# EAGLE board Main_Board (EAGLE 9.2.0), part 1 of 2
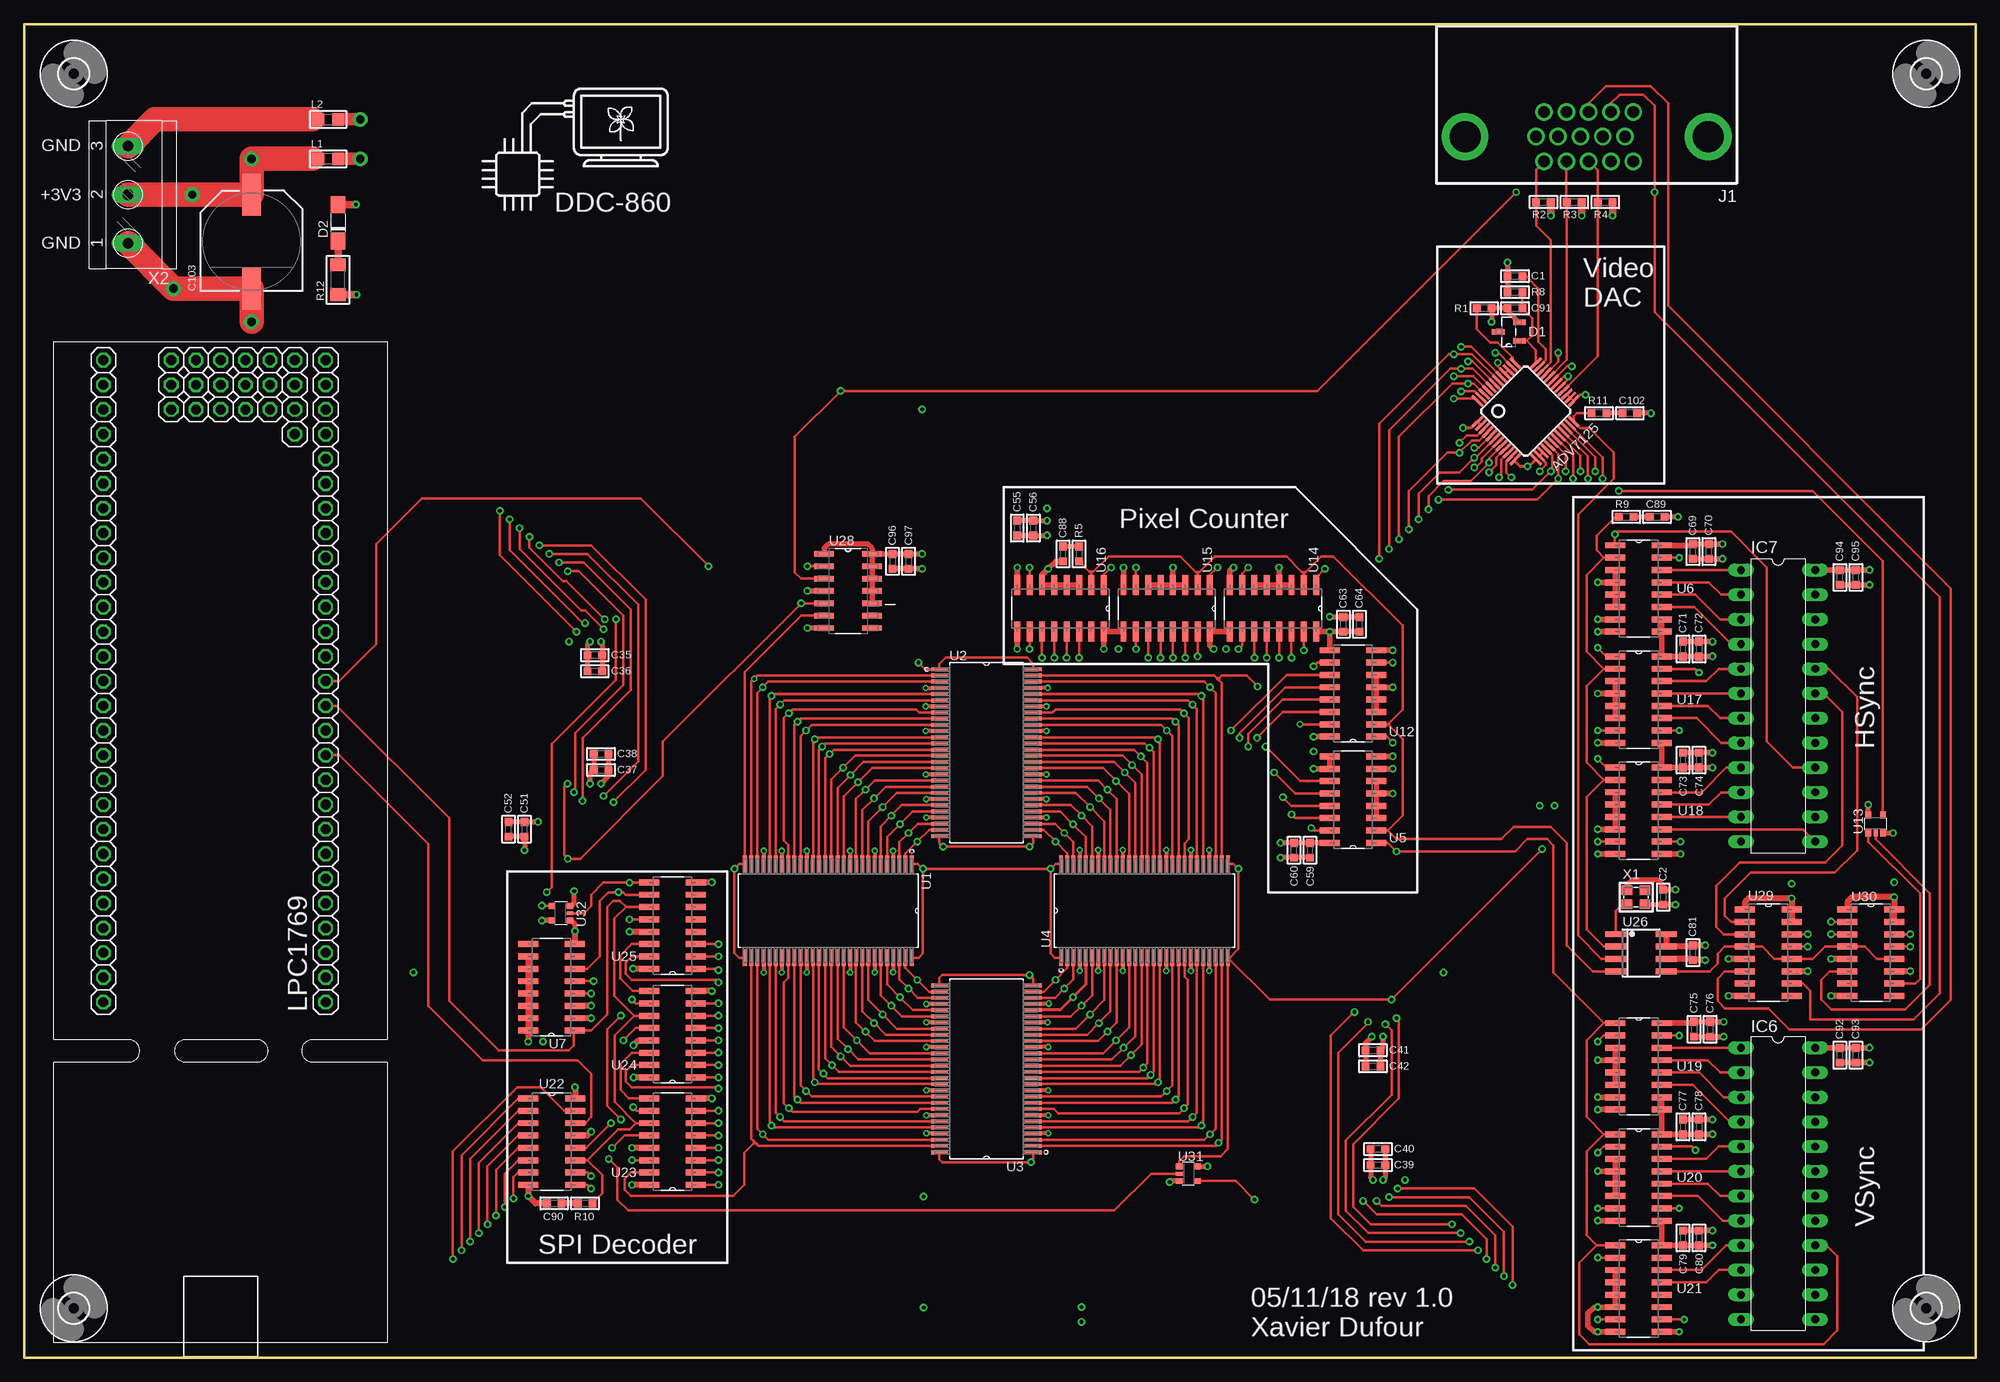
[diagram p4: board, top side]
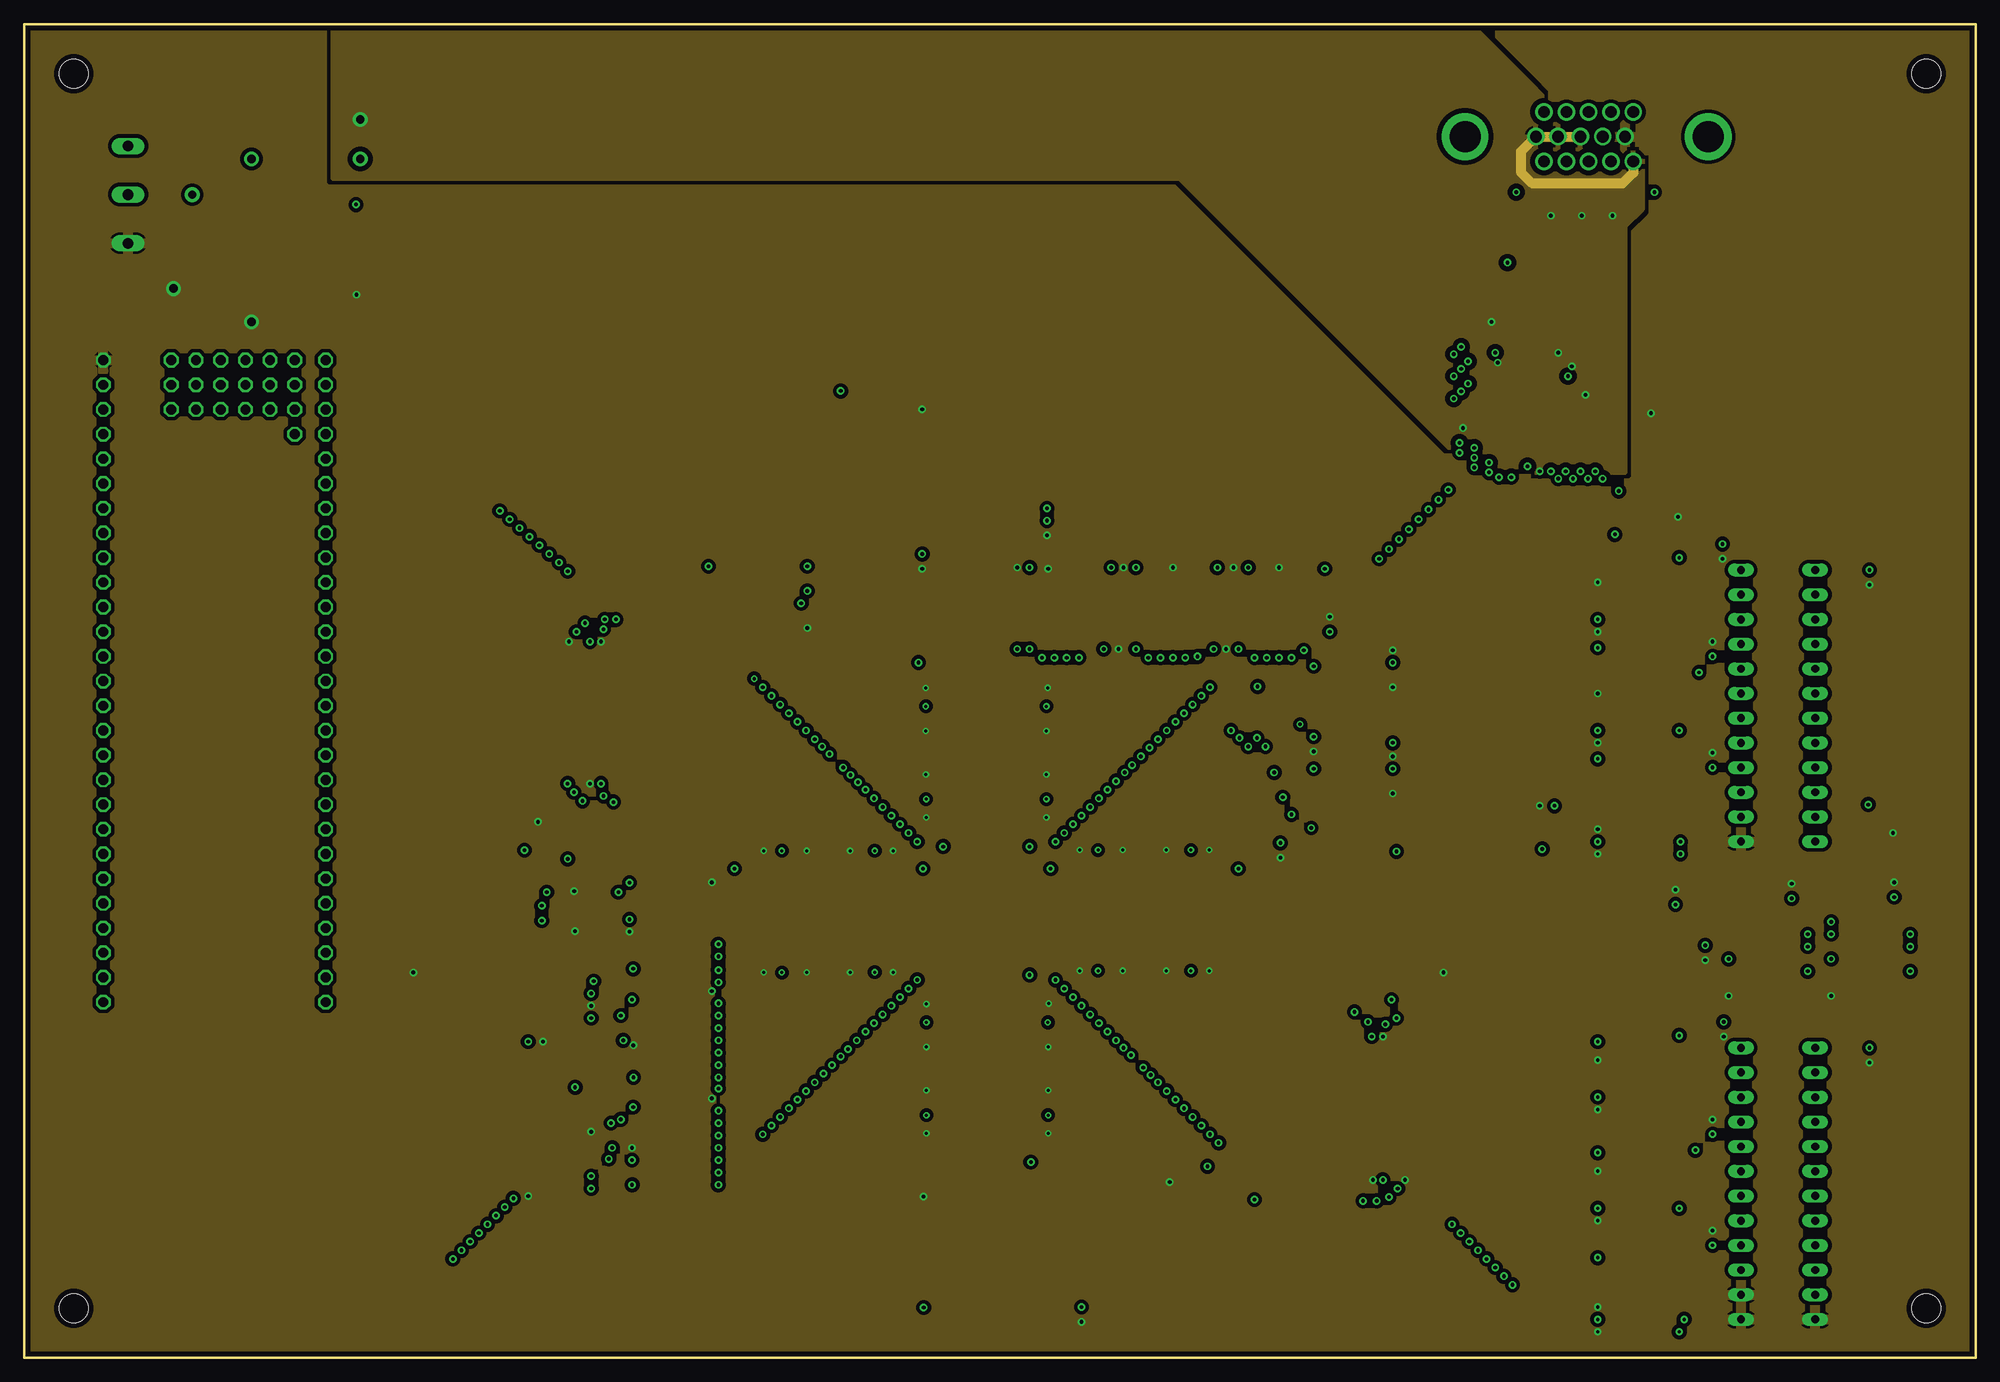
[diagram p5: board, inner layer GND]
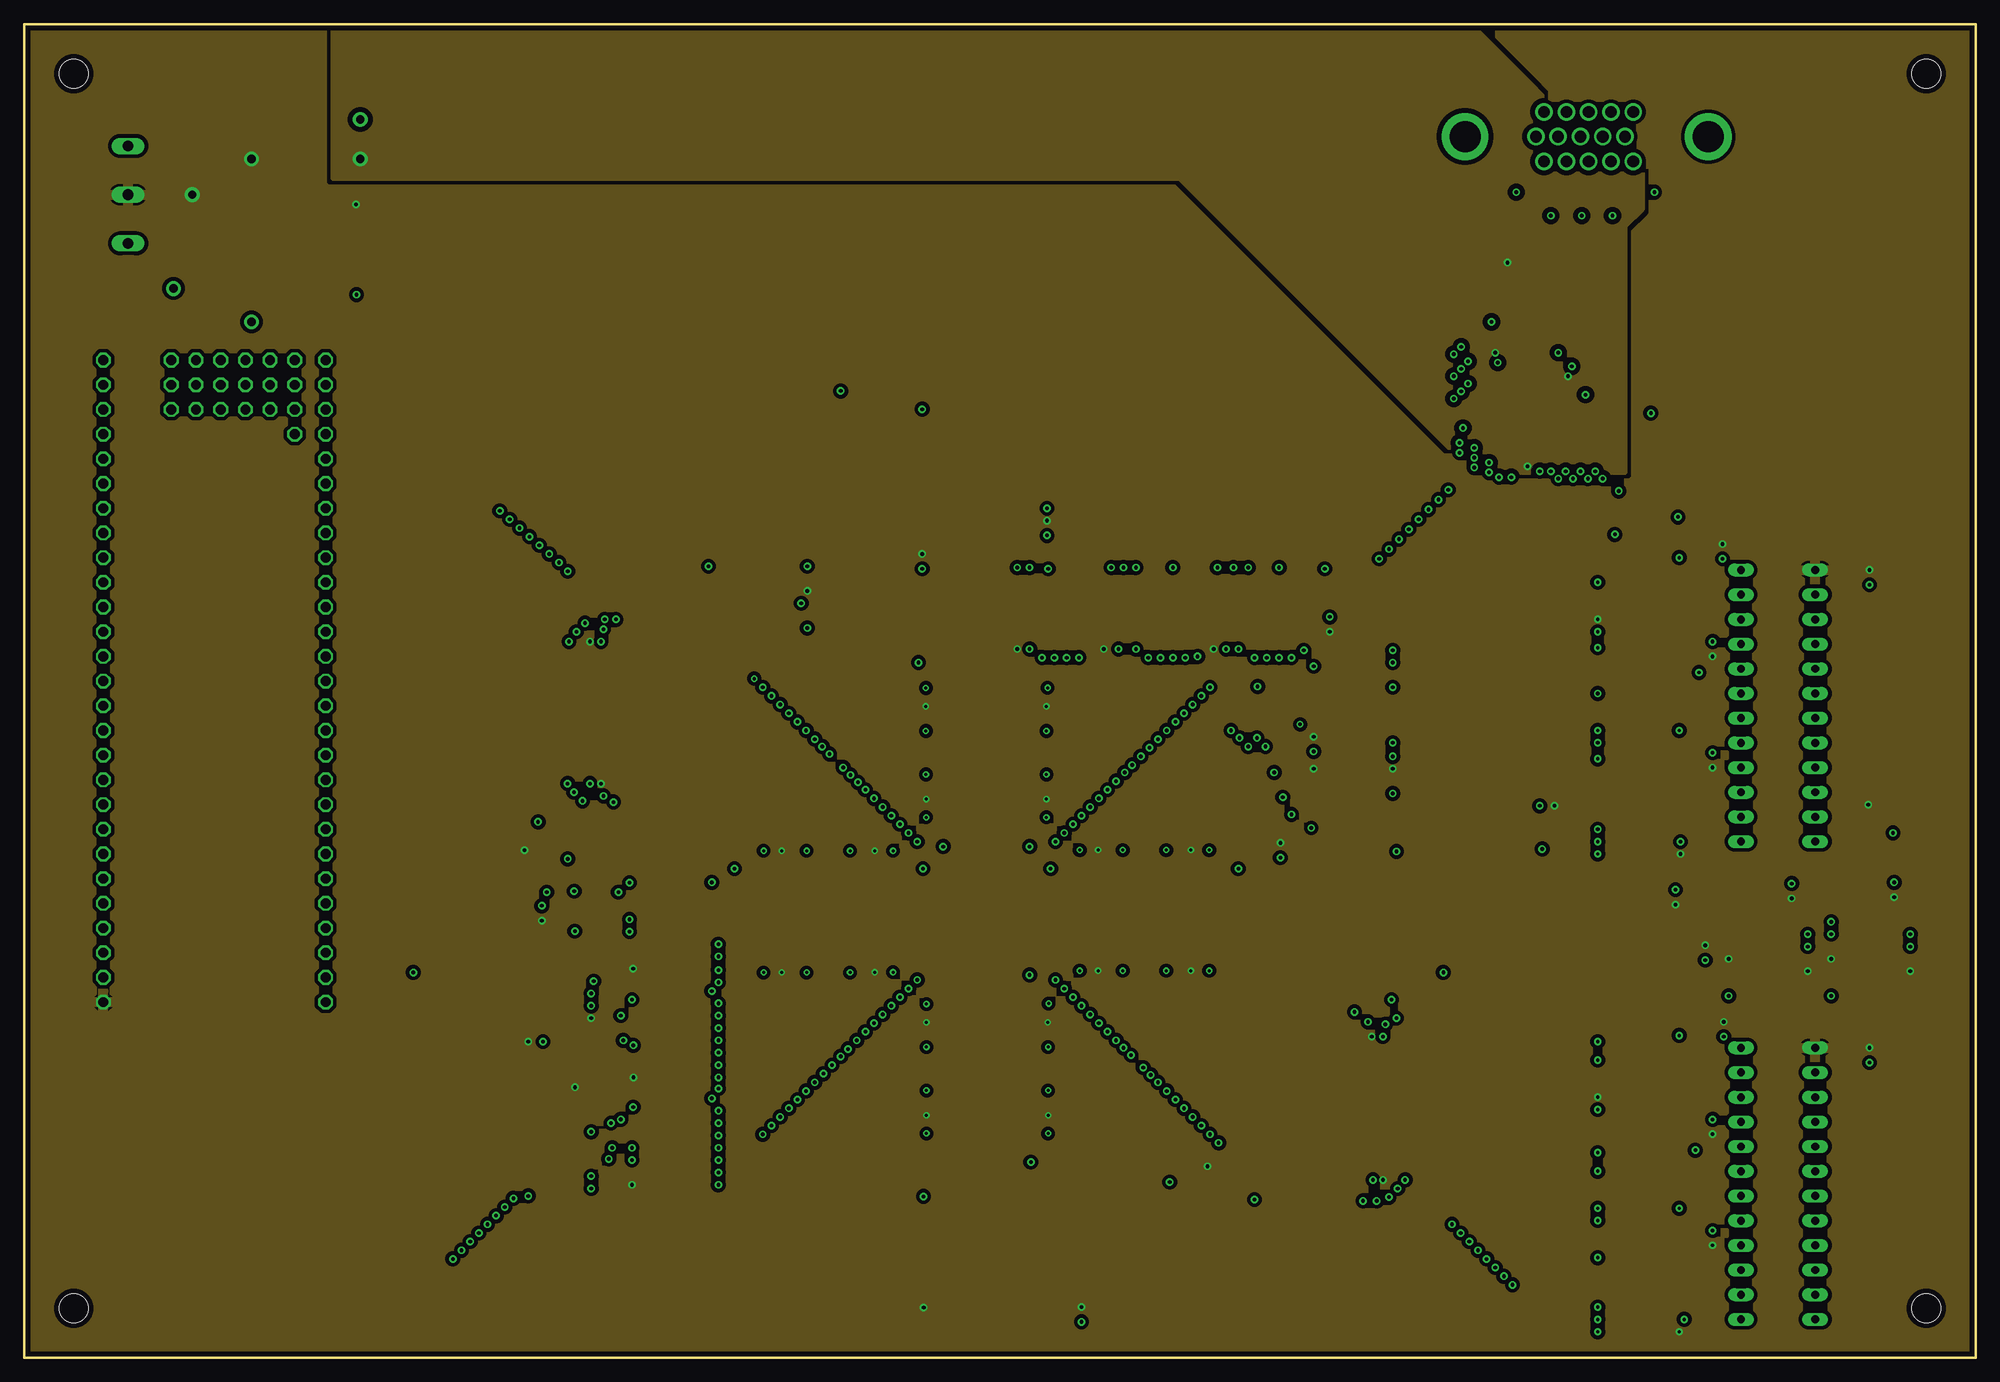
[diagram p6: board, inner layer PWR]
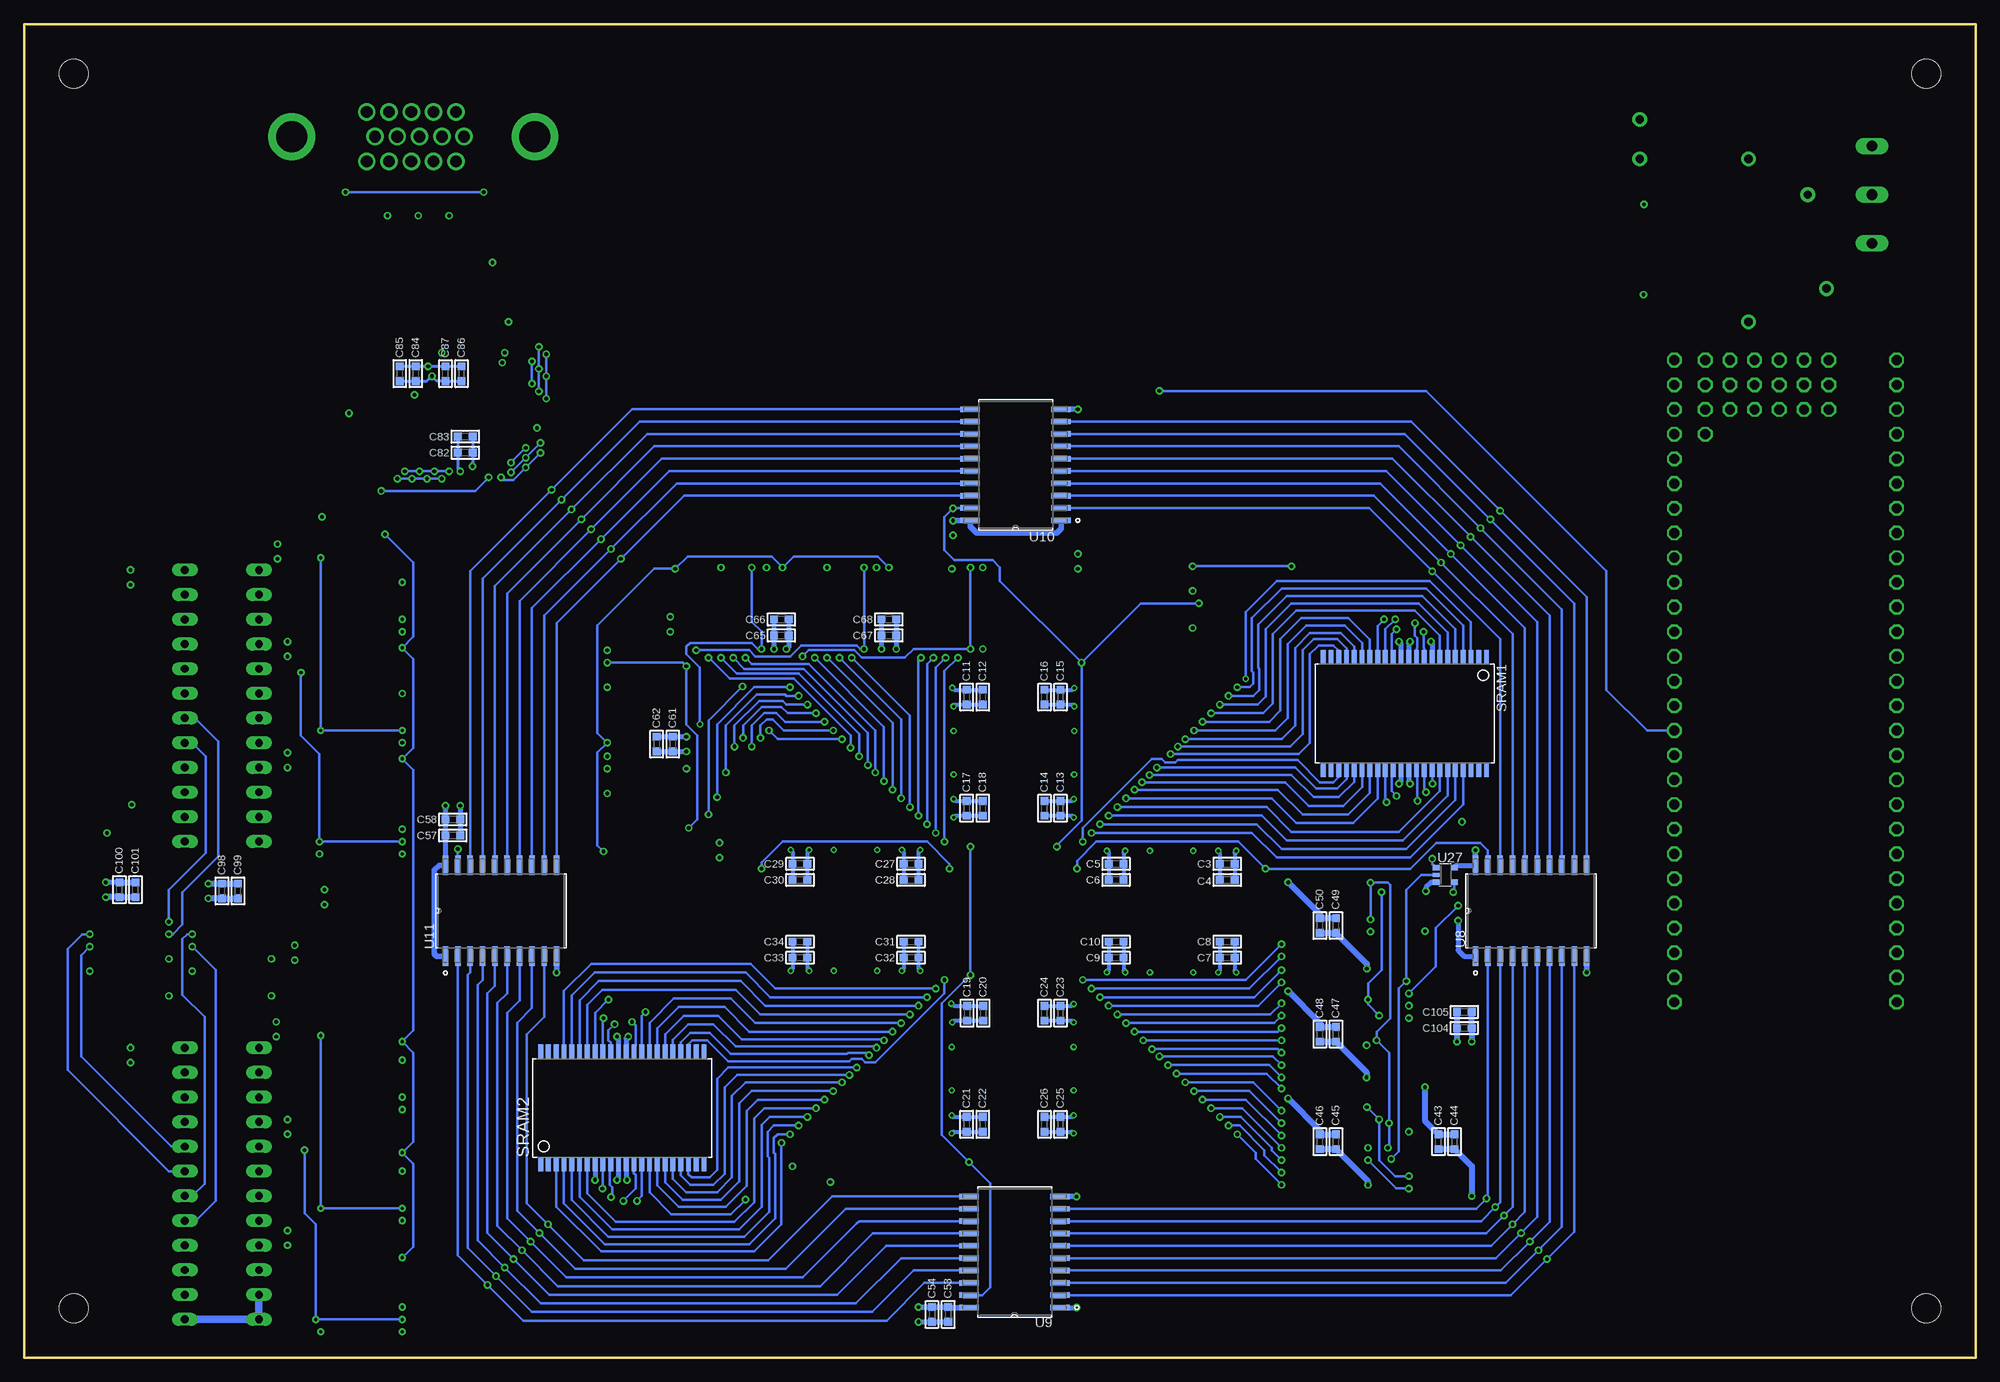
[diagram p7: board, bottom side, seen from below]

Size 200.66 x 137.16 mm. Coordinates in mm from the lower left corner, seen from the top.
Outline: 0,0 200.66,0 200.66,137.16 0,137.16 0,0
Copper layers (1+(2*15)+16): Top 0.035mm / dielectric 0.11mm / GND 0.035mm / dielectric 1.13mm / PWR 0.035mm / dielectric 0.11mm / Bottom 0.035mm
Design rules "DRCxav *": minimum track width 7mil, minimum drill 10mil, track to track 6mil, track to pad 6mil, pad to pad 6mil, via to via 6mil, smd to smd 6mil, copper to edge 20mil, drill to drill 10mil, minimum pad ring 10mil, minimum via ring 6mil, stop-mask expansion 0mil, vias tented up to drill 0mil, thermal gap 10mil

## Footprints (pad centres in the part's own frame; a part is rotated, then mirrored left to right if it is on the bottom)
LQFP48(SOT313) = smd 0.28 x 1.5: 1 -2.75,-4.25; 2 -2.25,-4.25; 3 -1.75,-4.25; 4 -1.25,-4.25; 5 -0.75,-4.25; 6 -0.25,-4.25; 7 0.25,-4.25; 8 0.75,-4.25; 9 1.25,-4.25; 10 1.75,-4.25; 11 2.25,-4.25; 12 2.75,-4.25; 25 2.75,4.25; 26 2.25,4.25; 27 1.75,4.25; 28 1.25,4.25; 29 0.75,4.25; 30 0.25,4.25; 31 -0.25,4.25; 32 -0.75,4.25; 33 -1.25,4.25; 34 -1.75,4.25; 35 -2.25,4.25; 36 -2.75,4.25 | smd 1.5 x 0.28: 13 4.25,-2.75; 14 4.25,-2.25; 15 4.25,-1.75; 16 4.25,-1.25; 17 4.25,-0.75; 18 4.25,-0.25; 19 4.25,0.25; 20 4.25,0.75; 21 4.25,1.25; 22 4.25,1.75; 23 4.25,2.25; 24 4.25,2.75; 37 -4.25,2.75; 38 -4.25,2.25; 39 -4.25,1.75; 40 -4.25,1.25; 41 -4.25,0.75; 42 -4.25,0.25; 43 -4.25,-0.25; 44 -4.25,-0.75; 45 -4.25,-1.25; 46 -4.25,-1.75; 47 -4.25,-2.25; 48 -4.25,-2.75
C0603 = smd 0.8 x 0.8: 1 -0.762,0; 2 0.762,0
CSV-G = smd 4.318 x 1.93: + -4.826,0; - 4.826,0
TO236-3(SOT23) = smd 1.321 x 0.559: 1 -1.092,0.94; 2 -1.092,-0.94; 3 1.092,0
DEL1206 = smd 1.75 x 1.5: A -1.875,0; C 1.875,0
3MM_HOLE = hole 3: 0,0
DIP24 = drill 0.813 long: 1 -13.97,-3.81; 2 -11.43,-3.81; 3 -8.89,-3.81; 4 -6.35,-3.81; 5 -3.81,-3.81; 6 -1.27,-3.81; 7 1.27,-3.81; 8 3.81,-3.81; 9 6.35,-3.81; 10 8.89,-3.81; 11 11.43,-3.81; 12 13.97,-3.81; 13 13.97,3.81; 14 11.43,3.81; 15 8.89,3.81; 16 6.35,3.81; 17 3.81,3.81; 18 1.27,3.81; 19 -1.27,3.81; 20 -3.81,3.81; 21 -6.35,3.81; 22 -8.89,3.81; 23 -11.43,3.81; 24 -13.97,3.81
DB15-VGA-90DEG = drill 1.194: 1 4.371,2.541; 2 2.08,2.541; 3 -0.211,2.541; 4 -2.502,2.541; 5 -4.793,2.541; 6 5.217,0; 7 2.926,0; 8 0.635,0; 9 -1.656,0; 10 -3.947,0; 11 4.371,-2.541; 12 2.08,-2.541; 13 -0.211,-2.541; 14 -2.502,-2.541; 15 -4.793,-2.541 | drill 3.2: P$1 -12.502,0; P$2 12.502,0
L0805 = smd 1.2 x 1.3: 1 -1.016,0; 2 1.016,0
LPCXPRESSO_LPC1769 = drill 1 octagon: 1 -18.161,-11.049; 2 -15.621,-11.049; 3 -13.081,-11.049; 4 -10.541,-11.049; 5 -8.001,-11.049; 6 -5.461,-11.049; 7 -2.921,-11.049; 8 -0.381,-11.049; 9 2.159,-11.049; 10 4.699,-11.049; 11 7.239,-11.049; 12 9.779,-11.049; 13 12.319,-11.049; 14 14.859,-11.049; 15 17.399,-11.049; 16 19.939,-11.049; 17 22.479,-11.049; 18 25.019,-11.049; 19 27.559,-11.049; 20 30.099,-11.049; 21 32.639,-11.049; 22 35.179,-11.049; 23 37.719,-11.049; 24 40.259,-11.049; 25 42.799,-11.049; 26 45.339,-11.049; 27 47.879,-11.049; 28 -18.161,11.811; 29 -15.621,11.811; 30 -13.081,11.811; 31 -10.541,11.811; 32 -8.001,11.811; 33 -5.461,11.811; 34 -2.921,11.811; 35 -0.381,11.811; 36 2.159,11.811; 37 4.699,11.811; 38 7.239,11.811; 39 9.779,11.811; 40 12.319,11.811; 41 14.859,11.811; 42 17.399,11.811; 43 19.939,11.811; 44 22.479,11.811; 45 25.019,11.811; 46 27.559,11.811; 47 30.099,11.811; 48 32.639,11.811; 49 35.179,11.811; 50 37.719,11.811; 51 40.259,11.811; 52 42.799,11.811; 53 45.339,11.811; 54 47.879,11.811; 55 40.259,-7.874; 56 42.799,-7.874; 57 45.339,-7.874; 58 47.879,-7.874; 59 42.799,-5.334; 60 45.339,-5.334; 61 47.879,-5.334; 62 42.799,-2.794; 63 45.339,-2.794; 64 47.879,-2.794; 65 42.799,-0.254; 66 45.339,-0.254; 67 47.879,-0.254; 68 42.799,2.286; 69 45.339,2.286; 70 47.879,2.286; 71 42.799,4.826; 72 45.339,4.826; 73 47.879,4.826
R0603 = smd 0.8 x 0.8: 1 -0.762,0; 2 0.762,0
R1206 = smd 1.3 x 1.6: 1 -1.524,0; 2 1.524,0
TSOPII-44 = smd 0.5 x 1.5: 1 -8.4,-5.777; 2 -7.6,-5.777; 3 -6.8,-5.777; 4 -6,-5.777; 5 -5.2,-5.777; 6 -4.4,-5.777; 7 -3.6,-5.777; 8 -2.8,-5.777; 9 -2,-5.777; 10 -1.2,-5.777; 11 -0.4,-5.777; 12 0.4,-5.777; 13 1.2,-5.777; 14 2,-5.777; 15 2.8,-5.777; 16 3.6,-5.777; 17 4.4,-5.777; 18 5.2,-5.777; 19 6,-5.777; 20 6.8,-5.777; 21 7.6,-5.777; 22 8.4,-5.777; 23 8.4,5.777; 24 7.6,5.777; 25 6.8,5.777; 26 6,5.777; 27 5.2,5.777; 28 4.4,5.777; 29 3.6,5.777; 30 2.8,5.777; 31 2,5.777; 32 1.2,5.777; 33 0.4,5.777; 34 -0.4,5.777; 35 -1.2,5.777; 36 -2,5.777; 37 -2.8,5.777; 38 -3.6,5.777; 39 -4.4,5.777; 40 -5.2,5.777; 41 -6,5.777; 42 -6.8,5.777; 43 -7.6,5.777; 44 -8.4,5.777
SSOP56(SOT371) = smd 1.727 x 0.406: 1 -4.826,8.585; 2 -4.826,7.925; 3 -4.826,7.315; 4 -4.826,6.655; 5 -4.826,6.045; 6 -4.826,5.385; 7 -4.826,4.775; 8 -4.826,4.115; 9 -4.826,3.505; 10 -4.826,2.845; 11 -4.826,2.235; 12 -4.826,1.575; 13 -4.826,0.965; 14 -4.826,0.305; 15 -4.826,-0.305; 16 -4.826,-0.965; 17 -4.826,-1.575; 18 -4.826,-2.235; 19 -4.826,-2.845; 20 -4.826,-3.505; 21 -4.826,-4.115; 22 -4.826,-4.775; 23 -4.826,-5.385; 24 -4.826,-6.045; 25 -4.826,-6.655; 26 -4.826,-7.315; 27 -4.826,-7.925; 28 -4.826,-8.585; 29 4.826,-8.585; 30 4.826,-7.925; 31 4.826,-7.315; 32 4.826,-6.655; 33 4.826,-6.045; 34 4.826,-5.385; 35 4.826,-4.775; 36 4.826,-4.115; 37 4.826,-3.505; 38 4.826,-2.845; 39 4.826,-2.235; 40 4.826,-1.575; 41 4.826,-0.965; 42 4.826,-0.305; 43 4.826,0.305; 44 4.826,0.965; 45 4.826,1.575; 46 4.826,2.235; 47 4.826,2.845; 48 4.826,3.505; 49 4.826,4.115; 50 4.826,4.775; 51 4.826,5.385; 52 4.826,6.045; 53 4.826,6.655; 54 4.826,7.315; 55 4.826,7.925; 56 4.826,8.585
SO16D(SOT109) = smd 2.057 x 0.61: 1 -2.388,4.445; 2 -2.388,3.175; 3 -2.388,1.905; 4 -2.388,0.635; 5 -2.388,-0.635; 6 -2.388,-1.905; 7 -2.388,-3.175; 8 -2.388,-4.445; 9 2.413,-4.445; 10 2.413,-3.175; 11 2.413,-1.905; 12 2.413,-0.635; 13 2.413,0.635; 14 2.413,1.905; 15 2.413,3.175; 16 2.413,4.445
SO20DW(SOT163) = smd 1.981 x 0.559: 1 -4.674,5.715; 2 -4.674,4.445; 3 -4.674,3.175; 4 -4.674,1.905; 5 -4.674,0.635; 6 -4.674,-0.635; 7 -4.674,-1.905; 8 -4.674,-3.175; 9 -4.674,-4.445; 10 -4.674,-5.715; 11 4.674,-5.715; 12 4.674,-4.445; 13 4.674,-3.175; 14 4.674,-1.905; 15 4.674,-0.635; 16 4.674,0.635; 17 4.674,1.905; 18 4.674,3.175; 19 4.674,4.445; 20 4.674,5.715
SC70-5(SOT353) = smd 0.6 x 0.7: 1 -0.75,-1; 3 0.75,-1; 4 0.75,0.85; 5 -0.75,0.85 | smd 0.4 x 0.7: 2 0,-1
SO08(SOT96) = smd 0.6 x 2.2: 1 -1.905,-2.6; 2 -0.635,-2.6; 3 0.635,-2.6; 4 1.905,-2.6; 5 1.905,2.6; 6 0.635,2.6; 7 -0.635,2.6; 8 -1.905,2.6
SO14(SOT108) = smd 1.981 x 0.559: 1 -2.464,3.81; 2 -2.464,2.54; 3 -2.464,1.27; 4 -2.464,0; 5 -2.464,-1.27; 6 -2.464,-2.54; 7 -2.464,-3.81; 8 2.464,-3.81; 9 2.464,-2.54; 10 2.464,-1.27; 11 2.464,0; 12 2.464,1.27; 13 2.464,2.54; 14 2.464,3.81
OSCXO2.5X2.0 = smd 1.05 x 0.95: 1 -0.925,-0.725; 2 0.925,-0.725; 3 0.925,0.725; 4 -0.925,0.725
TERMINAL-BLOCK-3-PIN-5MM = drill 1.1 pad 1.7 long: 1 -5,0; 2 0,0; 3 5,0

## Placement (x,y rotation side)
ADV7125  ADV7125  [LQFP48(SOT313)]  154.38,97.36 315 top
C1  0.1µF  [C0603]  153.29,111.25 180 top
C2  0.01µF  [C0603]  168.53,47.37 270 top
C3  0.01µF  [C0603]  76.96,50.8 180 bottom
C4  0.1µF  [C0603]  76.96,49.15 180 bottom
C5  0.01µF  [C0603]  88.39,50.8 0 bottom
C6  0.1µF  [C0603]  88.39,49.15 0 bottom
C7  0.01µF  [C0603]  76.96,41.15 180 bottom
C8  0.1µF  [C0603]  76.96,42.8 180 bottom
C9  0.01µF  [C0603]  88.39,41.15 0 bottom
C10  0.1µF  [C0603]  88.39,42.8 0 bottom
C11  0.01µF  [C0603]  103.76,67.94 270 bottom
C12  0.1µF  [C0603]  102.11,67.94 270 bottom
C13  0.01µF  [C0603]  94.11,56.52 90 bottom
C14  0.1µF  [C0603]  95.76,56.52 90 bottom
C15  0.01µF  [C0603]  94.11,67.94 270 bottom
C16  0.1µF  [C0603]  95.76,67.94 270 bottom
C17  0.01µF  [C0603]  103.76,56.52 90 bottom
C18  0.1µF  [C0603]  102.11,56.52 90 bottom
C19  0.01µF  [C0603]  103.71,35.43 270 bottom
C20  0.1µF  [C0603]  102.06,35.43 270 bottom
C21  0.01µF  [C0603]  103.76,24 90 bottom
C22  0.1µF  [C0603]  102.11,24 90 bottom
C23  0.01µF  [C0603]  94.11,35.43 270 bottom
C24  0.1µF  [C0603]  95.76,35.43 270 bottom
C25  0.01µF  [C0603]  94.11,24 90 bottom
C26  0.1µF  [C0603]  95.76,24 90 bottom
C27  0.01µF  [C0603]  109.47,50.8 180 bottom
C28  0.1µF  [C0603]  109.47,49.15 180 bottom
C29  0.01µF  [C0603]  120.9,50.8 0 bottom
C30  0.1µF  [C0603]  120.9,49.15 0 bottom
C31  0.01µF  [C0603]  109.47,42.8 180 bottom
C32  0.1µF  [C0603]  109.47,41.15 180 bottom
C33  0.01µF  [C0603]  120.9,41.15 0 bottom
C34  0.1µF  [C0603]  120.9,42.8 0 bottom
C35  0.01µF  [C0603]  58.67,72.26 180 top
C36  0.33µF  [C0603]  58.67,70.61 180 top
C37  0.01µF  [C0603]  59.31,60.45 0 top
C38  0.33µF  [C0603]  59.31,62.1 0 top
C39  0.01µF  [C0603]  139.19,19.81 0 top
C40  0.33µF  [C0603]  139.19,21.46 0 top
C41  0.01µF  [C0603]  138.68,31.62 180 top
C42  0.33µF  [C0603]  138.68,29.97 180 top
C43  0.01µF  [C0603]  55.24,22.23 90 bottom
C44  0.1µF  [C0603]  53.59,22.23 90 bottom
C45  0.01µF  [C0603]  65.79,22.23 270 bottom
C46  0.1µF  [C0603]  67.44,22.23 270 bottom
C47  0.01µF  [C0603]  65.79,33.27 270 bottom
C48  0.1µF  [C0603]  67.44,33.27 270 bottom
C49  0.01µF  [C0603]  65.79,44.45 270 bottom
C50  0.1µF  [C0603]  67.44,44.45 270 bottom
C51  0.01µF  [C0603]  51.44,54.36 270 top
C52  0.1µF  [C0603]  49.78,54.36 270 top
C53  0.01µF  [C0603]  105.66,4.45 90 bottom
C54  0.1µF  [C0603]  107.31,4.45 90 bottom
C55  0.01µF  [C0603]  102.11,85.34 90 top
C56  0.1µF  [C0603]  103.76,85.34 90 top
C57  0.01µF  [C0603]  156.59,53.72 180 bottom
C58  0.1µF  [C0603]  156.59,55.37 180 bottom
C59  0.01µF  [C0603]  132.21,52.2 90 top
C60  0.1µF  [C0603]  130.56,52.2 90 top
C61  0.01µF  [C0603]  133.99,63.12 90 bottom
C62  0.1µF  [C0603]  135.64,63.12 90 bottom
C63  0.01µF  [C0603]  135.64,75.44 270 top
C64  0.1µF  [C0603]  137.29,75.44 270 top
C65  0.01µF  [C0603]  122.81,74.3 0 bottom
C66  0.1µF  [C0603]  122.81,75.95 0 bottom
C67  0.01µF  [C0603]  111.76,74.3 0 bottom
C68  0.1µF  [C0603]  111.76,75.95 0 bottom
C69  0.01µF  [C0603]  171.58,82.93 90 top
C70  0.1µF  [C0603]  173.23,82.93 90 top
C71  0.01µF  [C0603]  170.56,72.9 270 top
C72  0.1µF  [C0603]  172.21,72.9 270 top
C73  0.01µF  [C0603]  170.56,61.47 270 top
C74  0.1µF  [C0603]  172.21,61.47 270 top
C75  0.01µF  [C0603]  171.7,33.78 90 top
C76  0.1µF  [C0603]  173.35,33.78 90 top
C77  0.01µF  [C0603]  170.56,23.75 270 top
C78  0.1µF  [C0603]  172.21,23.75 270 top
C79  0.01µF  [C0603]  170.56,12.32 270 top
C80  0.1µF  [C0603]  172.21,12.32 270 top
C81  0.01µF  [C0603]  171.58,41.66 90 top
C82  0.1µF  [C0603]  155.32,93.09 0 bottom
C83  0.01µF  [C0603]  155.32,94.74 0 bottom
C84  0.1µF  [C0603]  160.4,101.22 270 bottom
C85  0.01µF  [C0603]  162.05,101.22 270 bottom
C86  0.1µF  [C0603]  155.7,101.22 270 bottom
C87  0.01µF  [C0603]  157.35,101.22 270 bottom
C88  220pF  [C0603]  106.81,82.68 90 top
C89  220pF  [C0603]  167.89,86.49 180 top
C90  220pF  [C0603]  54.48,15.88 0 top
C91  0.1µF  [C0603]  153.29,107.95 0 top
C92  0.01µF  [C0603]  186.69,31.11 90 top
C93  0.33µF  [C0603]  188.34,31.11 90 top
C94  0.01µF  [C0603]  186.69,80.26 90 top
C95  0.33µF  [C0603]  188.34,80.26 90 top
C96  0.01µF  [C0603]  89.28,81.92 90 top
C97  0.1µF  [C0603]  90.93,81.92 90 top
C98  0.01µF  [C0603]  180.34,48.01 270 bottom
C99  0.1µF  [C0603]  178.69,48.01 270 bottom
C100  0.01µF  [C0603]  190.88,48.13 270 bottom
C101  0.1µF  [C0603]  189.23,48.13 270 bottom
C102  220pF  [C0603]  165.1,97.16 180 top
C103  470µF  [CSV-G]  23.37,114.81 270 top
C104  0.01µF  [C0603]  52.58,33.91 0 bottom
C105  0.1µF  [C0603]  52.58,35.56 0 bottom
D1  AD1580  [TO236-3(SOT23)]  152.65,105.54 180 top
D2  [DEL1206]  32.26,116.71 270 top
H1  3MM_SCREW  [3MM_HOLE]  5.08,5.08 0 top
H2  3MM_SCREW  [3MM_HOLE]  5.08,132.08 0 top
H3  3MM_SCREW  [3MM_HOLE]  195.58,5.08 0 top
H4  3MM_SCREW  [3MM_HOLE]  195.58,132.08 0 top
IC6  PALLV22V10  [DIP24]  180.34,17.91 270 top
IC7  PALLV22V10  [DIP24]  180.34,67.06 270 top
J1  VGA-DB15  [DB15-VGA-90DEG]  160.66,125.6 180 top
L1  L_0805  [L0805]  31.24,123.32 180 top
L2  L_0805  [L0805]  31.24,127.38 0 top
LPC1769  [LPCXPRESSO_LPC1769]  19.94,54.74 90 top
R1  560R  [R0603]  150.11,107.95 180 top
R2  75R  [R0603]  156.21,118.87 180 top
R3  75R  [R0603]  159.38,118.87 180 top
R4  75R  [R0603]  162.56,118.87 180 top
R5  42.2R  [R0603]  108.46,82.68 270 top
R8  1K  [R0603]  153.29,109.6 180 top
R9  42.2R  [R0603]  164.72,86.49 180 top
R10  42.2R  [R0603]  57.66,15.88 180 top
R11  42.2R  [R0603]  161.93,97.16 180 top
R12  330R  [R1206]  32.26,110.87 270 top
SRAM1  CY7C1059DV33  [TSOPII-44]  58.7,66.27 180 bottom
SRAM2  CY7C1059DV33  [TSOPII-44]  139.17,25.68 0 bottom
U1  74ALVCH16827DL  [SSOP56(SOT371)]  82.68,45.97 270 top
U2  74ALVCH16827DL  [SSOP56(SOT371)]  98.93,62.23 0 top
U3  74ALVCH16827DL  [SSOP56(SOT371)]  98.93,29.72 180 top
U4  74ALVCH16827DL  [SSOP56(SOT371)]  115.19,45.97 90 top
U5  74LVC163  [SO16D(SOT109)]  136.65,57.4 180 top
U6  74LVC163  [SO16D(SOT109)]  165.99,79.12 0 top
U7  74LVC112A  [SO16D(SOT109)]  54.23,38.1 180 top
U8  74LVC245A  [SO20DW(SOT163)]  45.72,45.97 90 bottom
U9  74LVC245A  [SO20DW(SOT163)]  98.83,10.87 180 bottom
U10  74LVC245A  [SO20DW(SOT163)]  98.73,91.85 180 bottom
U11  74LVC245A  [SO20DW(SOT163)]  151.64,45.97 90 bottom
U12  74LVC163  [SO16D(SOT109)]  136.65,68.33 180 top
U13  74LVC1G02  [SC70-5(SOT353)]  190.37,54.99 0 top
U14  74LVC163  [SO16D(SOT109)]  128.4,77.09 270 top
U15  74LVC163  [SO16D(SOT109)]  117.47,77.09 270 top
U16  74LVC163  [SO16D(SOT109)]  106.55,77.09 270 top
U17  74LVC163  [SO16D(SOT109)]  165.99,67.69 0 top
U18  74LVC163  [SO16D(SOT109)]  165.99,56.26 0 top
U19  74LVC163  [SO16D(SOT109)]  165.99,29.97 0 top
U20  74LVC163  [SO16D(SOT109)]  165.99,18.54 0 top
U21  74LVC163  [SO16D(SOT109)]  165.99,7.11 0 top
U22  74LVC595A  [SO16D(SOT109)]  54.23,22.23 0 top
U23  74LVC595A  [SO16D(SOT109)]  66.67,22.23 180 top
U24  74LVC595A  [SO16D(SOT109)]  66.67,33.27 180 top
U25  74LVC595A  [SO16D(SOT109)]  66.67,44.45 180 top
U26  ICS551  [SO08(SOT96)]  166.24,41.66 270 top
U27  74LVC1G00  [SC70-5(SOT353)]  54.48,49.66 270 bottom
U28  74LVC74AD  [SO14(SOT108)]  84.71,78.87 0 top
U29  74LVC109A  [SO16D(SOT109)]  179.32,41.66 0 top
U30  74LVC109A  [SO16D(SOT109)]  189.87,41.66 0 top
U31  74LVC1G00  [SC70-5(SOT353)]  119.76,18.92 270 top
U32  74AHC1G02DCK  [SC70-5(SOT353)]  55.12,45.72 90 top
X1  KC2520C-C2  [OSCXO2.5X2.0]  165.74,47.37 180 top
X2  5MM-3 BLOCK  [TERMINAL-BLOCK-3-PIN-5MM]  10.67,119.63 90 top